# EAGLE design GPS_Oszillator (EAGLE 7.6.0)
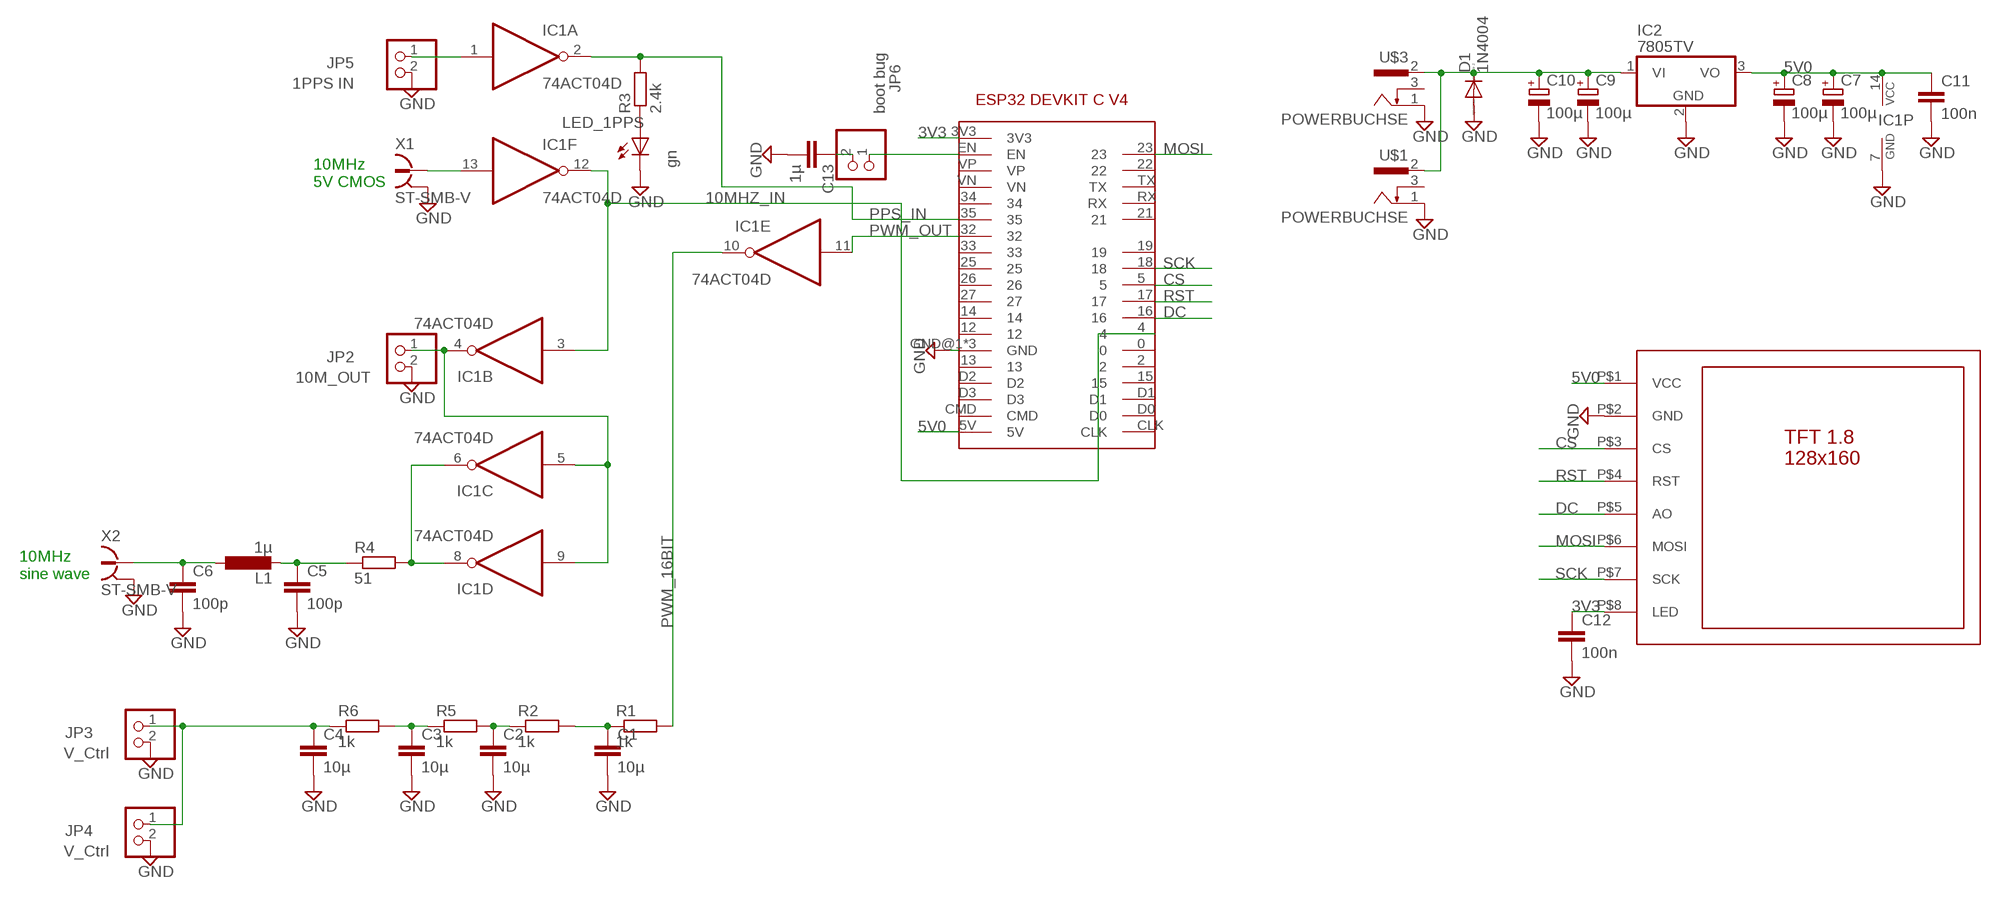
[diagram p0: schematic, sheet 1]

## Parts
C1  10µ  C-EUC1206  [C1206]
C2  10µ  C-EUC1206  [C1206]
C3  10µ  C-EUC1206  [C1206]
C4  10µ  C-EUC1206  [C1206]
C5  100p  C-EUC0805  [C0805]
C6  100p  C-EUC0805  [C0805]
C7  100µ  CPOL-EUSANYO_SMD_E7  [SANYO-OSCON_SMD_E7]
C8  100µ  CPOL-EUSANYO_SMD_E7  [SANYO-OSCON_SMD_E7]
C9  100µ  CPOL-EUSANYO_SMD_E7  [SANYO-OSCON_SMD_E7]
C10  100µ  CPOL-EUSANYO_SMD_E7  [SANYO-OSCON_SMD_E7]
C11  100n  C-EUC0805  [C0805]
C12  100n  C-EUC0805  [C0805]
C13  1µ  C-EUC1210  [C1210]
D1  1N4004  [DO41-10]
IC1  74ACT04D  [SO14]
IC2  7805TV  [TO220V]
JP2  10M_OUT  PINHD-1X2  [1X02]
JP3  V_Ctrl  PINHD-1X2  [1X02]
JP4  V_Ctrl  PINHD-1X2  [1X02]
JP5  1PPS IN  PINHD-1X2  [1X02]
JP6  boot bug  PINHD-1X2  [1X02]
L1  1µ  L-EUL1812  [L1812]
LED_1PPS  gn  LEDCHIPLED_0805  [CHIPLED_0805]
R1  1k  R-EU_R0805  [R0805]
R2  1k  R-EU_R0805  [R0805]
R3  2.4k  R-EU_R0805  [R0805]
R4  51  R-EU_R0805  [R0805]
R5  1k  R-EU_R0805  [R0805]
R6  1k  R-EU_R0805  [R0805]
U$1  POWERBUCHSE  [POWERBUCHSE]
U$2  TFT_18  [TFT_18]
U$3  POWERBUCHSE  [POWERBUCHSE]
U$4  ESP32_DEVKITC_V4  [ESP32_DEVKIT_C_V4]
X1  ST-SMB-V  [ST-SMB-V]
X2  ST-SMB-V  [ST-SMB-V]

## Nets
3V3: C12.1 U$2.P$8(LED) U$4.3V3
5V0: C7.+ C8.+ C11.1 IC1.14(P:VCC) IC2.3(VO) U$2.P$1(VCC) U$4.5V
10MHZ_IN: IC1.3(B:I) IC1.12(F:O) U$4.4
CS: U$2.P$3(CS) U$4.5
DC: U$2.P$5(AO) U$4.16
ESP32_EN: JP6.1 U$4.EN
GND: C1.2 C2.2 C3.2 C4.2 C5.2 C6.2 C7.- C8.- C9.- C10.- C11.2 C12.2 C13.2 D1.A IC1.7(P:GND) IC2.2(GND) JP2.2 JP3.2 JP4.2 JP5.2 LED_1PPS.C U$1.1 U$2.P$2(GND) U$3.1 U$4.GND@1(GND) U$4.GND@2(GND) U$4.GND@3(GND) X1.2 X1.3 X1.4 X1.5 X2.2 X2.3 X2.4 X2.5
MOSI: U$2.P$6(MOSI) U$4.23
N$1: C3.1 R5.1 R6.2
N$2: IC1.4(B:O) IC1.5(C:I) IC1.9(D:I) JP2.1
N$3: C2.1 R2.1 R5.2
N$4: C13.1 JP6.2
N$5: C1.1 R1.1 R2.2
N$6: C4.1 JP3.1 JP4.1 R6.1
N$7: IC1.1(A:I) JP5.1
N$8: LED_1PPS.A R3.1
N$9: C6.1 L1.1 X2.1
N$10: C5.1 L1.2 R4.1
N$11: IC1.6(C:O) IC1.8(D:O) R4.2
N$12: C9.+ C10.+ D1.C IC2.1(VI) U$1.2 U$3.2
N$13: IC1.13(F:I) X1.1
PPS_IN: IC1.2(A:O) R3.2 U$4.35
PWM_16BIT: IC1.10(E:O) R1.2
PWM_OUT: IC1.11(E:I) U$4.32
RST: U$2.P$4(RST) U$4.17
SCK: U$2.P$7(SCK) U$4.18
Unconnected: U$1.3 U$3.3 U$4.0 U$4.2 U$4.12 U$4.13 U$4.14 U$4.15 U$4.19 U$4.21 U$4.22 U$4.25 U$4.26 U$4.27 U$4.33 U$4.34 U$4.CLK U$4.CMD U$4.D0 U$4.D1 U$4.D2 U$4.D3 U$4.RX U$4.TX U$4.VN U$4.VP

## Notes on the sheet
- 10MHz
  5V CMOS
- 10MHz
  sine wave

## Library data of the parts
C1-C6 C11-C13 = rcl:C-EU: CAPACITOR, European symbol
C7-C10 = rcl:CPOL-EU: POLARIZED CAPACITOR, European symbol
D1 = diode:1N4004: DIODE general purpose rectifier, 1 A
IC1 = 74xx-eu:74*04: Hex INVERTER
IC2 = linear:78*: Positive VOLTAGE REGULATOR Source: http://cache.national.com/ds/LM/LM78L05.pdf http://www.fairchildsemi.com/ds/LM/LM7805.pdf
JP2-JP6 = pinhead:PINHD-1X2: PIN HEADER
L1 = rcl:L-EU: INDUCTOR, European symbol
LED_1PPS = led:LED: LED OSRAM: - CHIPLED LG R971, LG N971, LY N971, LG Q971, LY Q971, LO R971, LY R971 LH N974, LH R974 LS Q976, LO Q976, LY Q976 LO Q996 - Hyper CHIPLED LW Q18S LB Q993, LB Q99A, LB R99A - SideLED LS A670, LO A670, LY A670, LG A670, LP A670 LB A673, LV A673, LT A673, LW A673 LH A674 LY A675 LS A676, LA A676, LO A676, LY A676, LW A676 LS A679, LY A679, LG A679 - Hyper Micro SIDELED® LS Y876, LA Y876, LO Y876, LY Y876 LT Y87S - SmartLED LW L88C, LW L88S LB L89C, LB L89S, LG L890 LS L89K, LO L89K, LY L89K LS L896, LA L896, LO L896, LY L896 - TOPLED LS T670, LO T670, LY T670, LG T670, LP T670 LSG T670, LSP T670, LSY T670, LOP T670, LYG T670 LG T671, LOG T671, LSG T671 LB T673, LV T673, LT T673, LW T673 LH T674 LS T676, LA T676, LO T676, LY T676, LB T676, LH T676, LSB T676, LW T676 LB T67C, LV T67C, LT T67C, LS T67K, LO T67K, LY T67K, LW E67C LS E67B, LA E67B, LO E67B, LY E67B, LB E67C, LV E67C, LT E67C LW T67C LS T679, LY T679, LG T679 LS T770, LO T770, LY T770, LG T770, LP T770 LB T773, LV T773, LT T773, LW T773 LH T774 LS E675, LA E675, LY E675, LS T675 LS T776, LA T776, LO T776, LY T776, LB T776 LHGB T686 LT T68C, LB T68C - Hyper Mini TOPLED® LB M676 - Mini TOPLED Santana® LG M470 LS M47K, LO M47K, LY M47K Source: http://www.osram.convergy.de LUXEON: - LUMILED® LXK2-PW12-R00, LXK2-PW12-S00, LXK2-PW14-U00, LXK2-PW14-V00 LXK2-PM12-R00, LXK2-PM12-S00, LXK2-PM14-U00 LXK2-PE12-Q00, LXK2-PE12-R00, LXK2-PE12-S00, LXK2-PE14-T00, LXK2-PE14-U00 LXK2-PB12-K00, LXK2-PB12-L00, LXK2-PB12-M00, LXK2-PB14-N00, LXK2-PB14-P00, LXK2-PB14-Q00 LXK2-PR12-L00, LXK2-PR12-M00, LXK2-PR14-Q00, LXK2-PR14-R00 LXK2-PD12-Q00, LXK2-PD12-R00, LXK2-PD12-S00 LXK2-PH12-R00, LXK2-PH12-S00 LXK2-PL12-P00, LXK2-PL12-Q00, LXK2-PL12-R00 Source: www.luxeon.com KINGBRIGHT: KA-3528ASYC Source: www.kingbright.com
R1-R6 = rcl:R-EU_: RESISTOR, European symbol
U$1 U$3 = _Winni:POWERBUCHSE
U$2 = _Winni:TFT_18
U$4 = _Winni:ESP32_DEVKITC_V4
X1 X2 = con-coax:ST-SMB-V: MALE SMB CONNECTOR Radiall distributor RS 193-8855G7; OC_FARNELL: unknown; OC_NEWARK: unknown

## Board
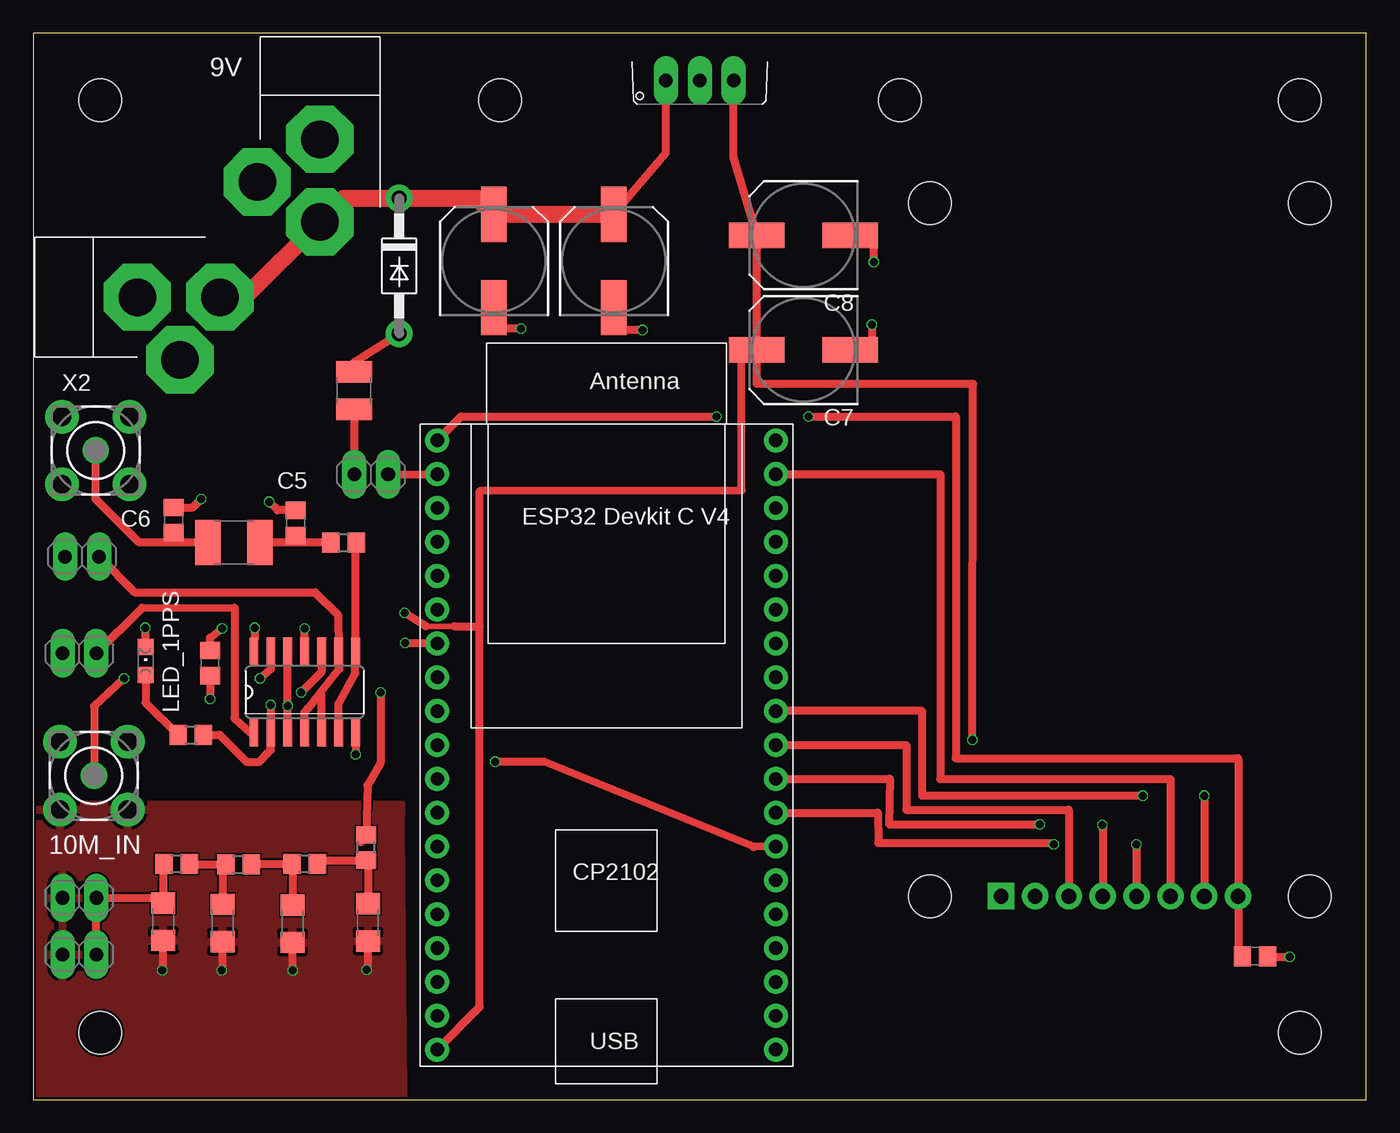
[diagram p1: board, top side]
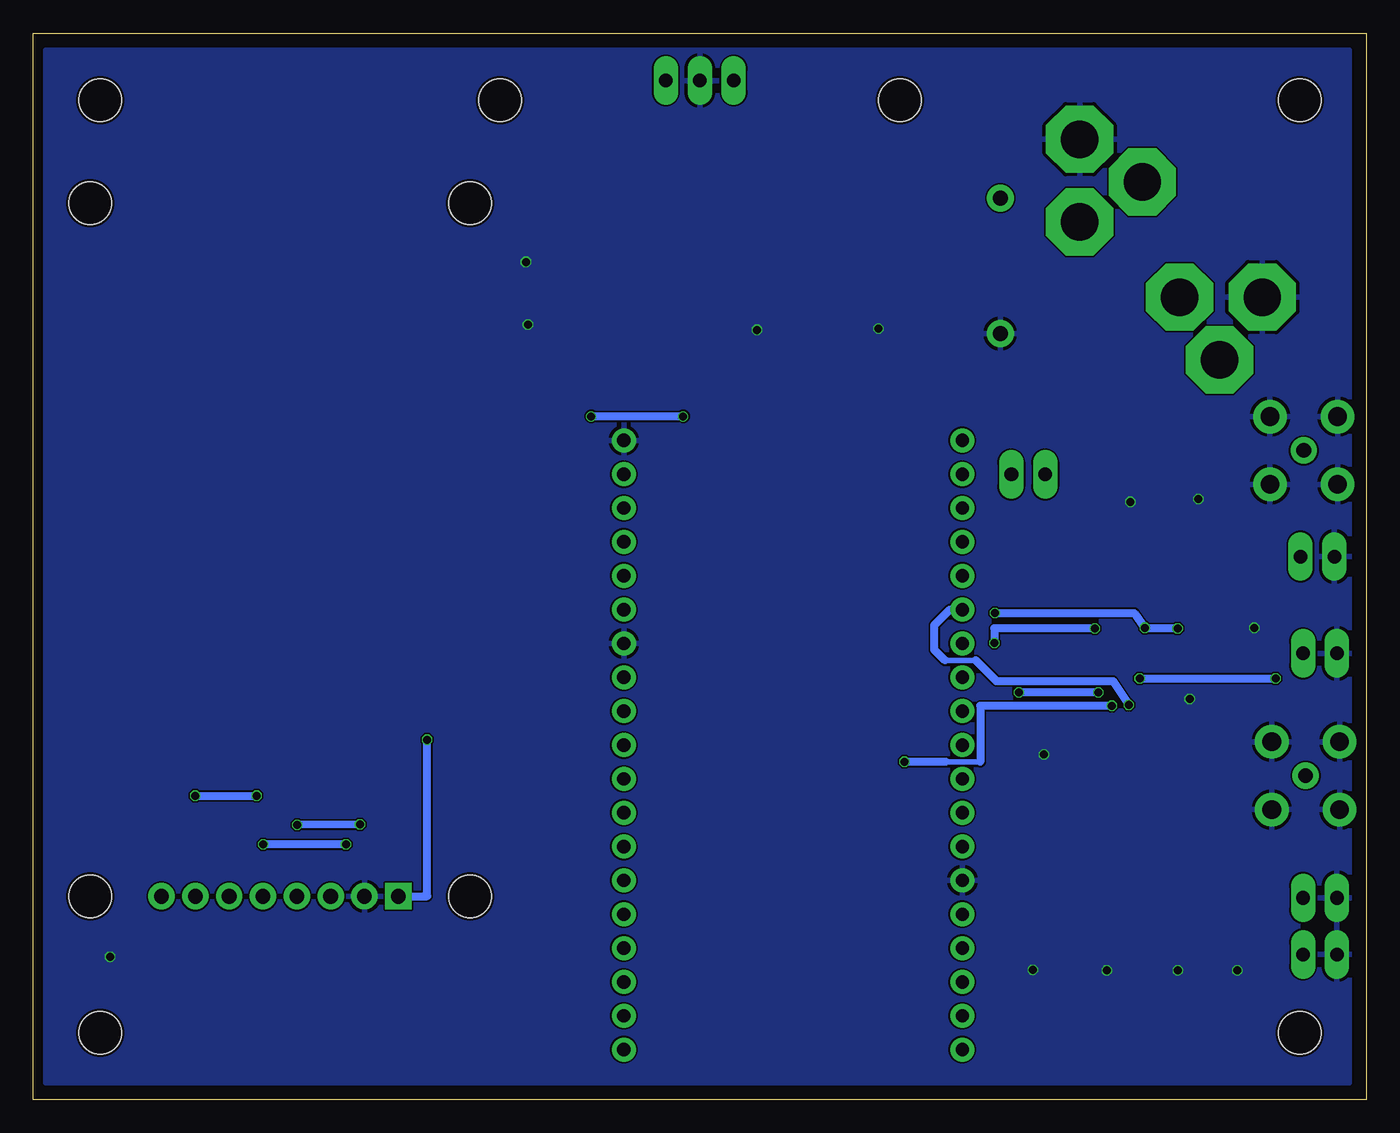
[diagram p2: board, bottom side, seen from below]

Size 100 x 80 mm. Coordinates in mm from the lower left corner, seen from the top.
Outline: 0,0 100,0 100,80 0,80 0,0
Copper layers (1*16): Top 0.035mm / dielectric 1.6mm / Bottom 0.035mm
Design rules "jlcpcb-2layers": minimum track width 5mil, minimum drill 0.3mm, track to track 5mil, track to pad 5mil, pad to pad 5mil, via to via 5mil, smd to smd 5mil, copper to edge 0.2mm, drill to drill 6mil, minimum pad ring 10mil, minimum via ring 3mil, stop-mask expansion 4mil, vias tented up to drill 0mil, thermal gap 10mil
Holes 3.2 mm at 5,5 95,5 95,75 5,75 65,75 35,75

### Footprints (pad centres in the part's own frame; a part is rotated, then mirrored left to right if it is on the bottom)
C1206 = smd 1.6 x 1.8: 1 -1.4,0; 2 1.4,0
C0805 = smd 1.3 x 1.5: 1 -0.95,0; 2 0.95,0
SANYO-OSCON_SMD_E7 = smd 4.15 x 1.9: + 3.5,0; - -3.5,0
C1210 = smd 1.6 x 2.7: 1 -1.4,0; 2 1.4,0
DO41-10 = drill 1.118: A 5.08,0; C -5.08,0
SO14 = smd 0.66 x 2.032: 1 -3.81,-3.073; 2 -2.54,-3.073; 3 -1.27,-3.073; 4 0,-3.073; 5 1.27,-3.073; 6 2.54,-3.073; 7 3.81,-3.073; 8 3.81,3.073; 9 2.54,3.073; 10 1.27,3.073; 11 0,3.073; 12 -1.27,3.073; 13 -2.54,3.073; 14 -3.81,3.073
TO220V = drill 1.016 long: 1 -2.54,-2.54; 2 0,-2.54; 3 2.54,-2.54
1X02 = drill 1.016 long: 1 -1.27,0; 2 1.27,0
L1812 = smd 1.9 x 3.4: 1 -1.95,0; 2 1.95,0
CHIPLED_0805 = smd 1.2 x 1.2: A 0,-1.05; C 0,1.05
R0805 = smd 1.3 x 1.5: 1 -0.95,0; 2 0.95,0
POWERBUCHSE = drill 2.8 octagon: 1 0,0; 2 0,-6.2; 3 -4.7,-3.2
TFT_18 = drill 1.1 square: P$1 -26,8.89 | drill 1.1: P$2 -26,6.35; P$3 -26,3.81; P$4 -26,1.27; P$5 -26,-1.27; P$6 -26,-3.81; P$7 -26,-6.35; P$8 -26,-8.89 | hole 3.2: -26,14.25; 26,14.25; -26,-14.25; 26,-14.25
ESP32_DEVKIT_C_V4 = drill 1: 0 12.7,-10.16; 2 12.7,-12.7; 3V3 -12.7,22.86; 4 12.7,-7.62; 5 12.7,0; 5V -12.7,-22.86; 12 -12.7,-7.62; 13 -12.7,-12.7; 14 -12.7,-5.08; 15 12.7,-15.24; 16 12.7,-5.08; 17 12.7,-2.54; 18 12.7,2.54; 19 12.7,5.08; 21 12.7,10.16; 22 12.7,17.78; 23 12.7,20.32; 25 -12.7,2.54; 26 -12.7,0; 27 -12.7,-2.54; 32 -12.7,7.62; 33 -12.7,5.08; 34 -12.7,12.7; 35 -12.7,10.16; CLK 12.7,-22.86; CMD -12.7,-20.32; D0 12.7,-20.32; D1 12.7,-17.78; D2 -12.7,-15.24; D3 -12.7,-17.78; EN -12.7,20.32; GND@1 -12.7,-10.16; GND@2 12.7,7.62; GND@3 12.7,22.86; RX 12.7,12.7; TX 12.7,15.24; VN -12.7,15.24; VP -12.7,17.78
ST-SMB-V = drill 1.1: 1 0,0 | drill 1.4: 2 -2.54,2.54; 3 2.54,2.54; 4 2.54,-2.54; 5 -2.54,-2.54

### Placement (x,y rotation side)
C1  25.1,13.3 270 top
C2  19.45,13.2 270 top
C3  14.2,13.25 270 top
C4  9.75,13.35 270 top
C5  19.68,43.27 90 top
C6  10.53,43.47 90 top
C7  57.78,56.25 180 top
C8  57.78,64.85 180 top
C9  43.55,62.92 90 top
C10  34.55,62.92 90 top
C11  13.25,32.75 270 top
C12  91.65,10.75 0 top
C13  24.05,53.2 90 top
D1  27.45,62.55 270 top
IC1  20.36,30.57 0 top
IC2  50,79 0 top
JP2  3.66,40.74 180 top
JP3  3.46,15.13 180 top
JP4  3.46,10.88 180 top
JP5  3.46,33.48 180 top
JP6  25.35,46.9 180 top
L1  15.05,41.8 0 top
LED_1PPS  8.43,32.89 0 top
R1  24.98,18.91 90 top
R2  20.35,17.7 0 top
R3  11.82,27.37 0 top
R4  23.28,41.8 0 top
R5  15.4,17.65 0 top
R6  10.75,17.7 0 top
U$1  7.8,60.2 90 top
U$2  81.5,41.25 90 top
U$3  21.5,72.05 0 top
U$4  43,26.6 0 top
X1  4.54,24.3 0 top
X2  4.68,48.7 0 top

### Tracks (layer width: path | path; a pad name or v marks a point on that pad's centre or on a via)
3V3  (via drill 0.6)
  Top 0.61: 90.6,10.75 C12.1 90.39,10.75 U$2.P$8 90.39,25.6 69.2,25.6 69.2,51.25 v58.15,51.25 | U$4.3V3 32.09,51.25 v51.25,51.25
  Bottom 0.61: v51.25,51.25 v58.15,51.25
5V0  (via drill 0.6)
  Top 0.406: 31.6,35.5 29.45,35.5
  Top 0.61: C7.+ C8.+ 52.54,70.73 IC2.3 | 29.45,35.5 v27.85,36.5 | v16.6,35.4 IC1.14 | C11.1 13.25,34.65 v14.15,35.35 | v70.45,27 70.5,53.7 54.28,53.7 C7.+ | C7.+ 53.14,56.25 53.14,45.7 33.5,45.66 33.5,35.5 | U$4.5V 33.5,6.94 33.5,35.5 | 31.6,35.5 33.5,35.5
  Bottom 0.61: U$2.P$1 70.45,15.26 v70.45,27 | v27.85,36.5 17.4,36.5 v16.6,35.4 16.55,35.35 v14.15,35.35
10MHZ_IN  (via drill 0.6)
  Top 0.61: U$4.4 54.05,18.95 38.35,25.35 v34.65,25.35 | 19.1,27.49 IC1.3 v19.09,29.55 IC1.12
  Bottom 0.406: 28.95,25.35 31.55,25.35
  Bottom 0.61: v19.09,29.55 28.95,29.55 28.95,25.35 | 31.55,25.35 v34.65,25.35
CS
  Top 0.61: U$4.5 65.5,26.6 65.5,21.75 77.69,21.75 U$2.P$3
DC  (via drill 0.6)
  Top 0.61: U$4.16 63.35,21.52 63.4,19.25 76.6,19.25 v76.55,19.15 | v82.75,19.15 82.77,18.7 U$2.P$5
  Bottom 0.61: v76.55,19.15 v82.75,19.15 82.85,19.15
ESP32_EN
  Top 0.61: JP6.1 29.44,46.92 U$4.EN
GND  (via drill 0.6)
  Top 0.61: 43.1,59.4 C9.- 43.55,57.75 v45.7,57.75 | C11.2 v13.25,30.05 | IC1.7 v24.17,25.88 | C12.2 92.6,10.7 v94.25,10.7 | 2.48,9.49 JP4.2 | C13.2 24.07,55.35 D1.A | v25.02,9.73 25.1,9.81 C1.2 | v19.47,9.68 19.45,9.7 C2.2 | v14.12,9.68 14.2,9.76 C3.2 | v9.67,9.68 9.75,9.76 C4.2 | LED_1PPS.C 8.43,35.37 v8.4,35.4 | C6.2 11.97,44.42 v12.6,45.05 | C5.2 18.33,44.22 v17.7,44.85 | v63.05,62.85 63.05,64.23 C8.- | v62.9,58.15 62.9,57.02 C7.- | v36.6,57.85 34.55,57.85 C10.-
  pour Bottom: 1.27,78.74 1.27,1.27 99.06,1.27 99.06,78.74
  pour Top: 27.6,22.15 27.55,20.4 27.75,0.3 0.35,0 0.2,22.15
MOSI
  Top 0.61: U$4.23 68.05,46.92 68.05,24.05 85.31,24.05 U$2.P$6
N$1
  Top 0.61: R6.2 11.75,17.65 R5.1 14.2,17.4 C3.1
N$2
  Top 0.61: IC1.4 20.35,27 20.35,29.05 20.57,29.32 21.5,30.48 | 21.5,30.48 22.95,32.3 IC1.9 22.85,36.35 21.15,38.05 7.62,38.05 JP2.1 | IC1.5 21.63,30.35 21.5,30.48
N$3
  Top 0.61: R5.2 16.4,17.7 R2.1 19.45,17.65 C2.1
N$4
  Top 0.61: C13.1 24.08,50.62 JP6.2
N$5
  Top 0.61: R2.2 21.56,17.96 R1.1 25.1,17.84 C1.1
N$6
  Top 0.406: JP4.1 4.65,9.86 4.73,9.94
  Top 0.61: JP4.1 4.75,9.76 | R6.1 9.75,17.65 C4.1 9.37,15.13 JP3.1 4.73,9.94
N$7
  Top 0.61: JP5.1 8.15,36.9 15.1,36.91 15.1,28.6 16.25,27.55 IC1.1
N$8
  Top 0.61: LED_1PPS.A 8.43,29.76 R3.1
N$9
  Top 0.61: L1.1 10.55,41.8 | 10.55,41.8 7.95,41.8 4.68,45.07 X2.1 | C6.1 10.53,41.82 10.55,41.8
N$10
  Top 0.61: R4.1 19.7,41.8 | 19.7,41.8 L1.2 | C5.1 19.68,41.82 19.7,41.8
N$11
  Top 0.61: IC1.6 22.9,29.7 24.15,31.97 IC1.8 24.17,40.7 R4.2
N$12
  Top 0.61: C9.+ 47.46,71.02 IC2.1
  Top 1.27: C9.+ C10.+ 33.34,67.63 D1.C 23.28,67.63 U$3.2 15.85,60.2 U$1.2
N$13  (via drill 0.6)
  Top 0.61: IC1.13 17.82,32.27 v17,31.6 | v6.8,31.6 4.55,29.5 X1.1
  Bottom 0.61: v17,31.6 v6.8,31.6
PPS_IN  (via drill 0.6)
  Top 0.61: v17.82,29.6 IC1.2 17.82,26.22 16.95,25.35 16,25.35 13.98,27.37 R3.2
  Bottom 0.406: 29.3,32.95 31.6,32.95
  Bottom 0.61: 29.3,32.95 27.75,31.4 19,31.4 v17.82,29.6 | 31.6,32.95 32.4,33.75 32.4,35.6 31.24,36.76 U$4.35
PWM_16BIT  (via drill 0.6)
  Top 0.61: 24.59,19.3 R1.2 25.08,23.58 26.05,25.25 v26.05,30.55 | IC1.10 21.63,32.08 v20.1,30.55
  Bottom 0.61: v20.1,30.55 v26.05,30.55
PWM_OUT  (via drill 0.6)
  Top 0.61: IC1.11 v20.36,35.34 v20.35,35.35 | U$4.32 27.93,34.22 v27.9,34.25
  Bottom 0.61: v20.35,35.35 27.9,35.35 v27.9,34.25
RST  (via drill 0.6)
  Top 0.61: U$4.17 64.25,24.06 64.2,20.65 v75.5,20.65 | v80.2,20.6 80.23,20.3 U$2.P$4
  Bottom 0.61: v75.5,20.65 v80.2,20.6
SCK  (via drill 0.6)
  Top 0.61: v87.85,22.8 U$2.P$7 | U$4.18 66.7,29.14 66.7,22.8 v83.25,22.8
  Bottom 0.61: v87.85,22.8 v83.25,22.8

### Text on the board
tNames: 9V | 10M_IN
tValues: sine / wave